# Altium schematic sheet 原理图.schdoc
size 430 x 307 mm
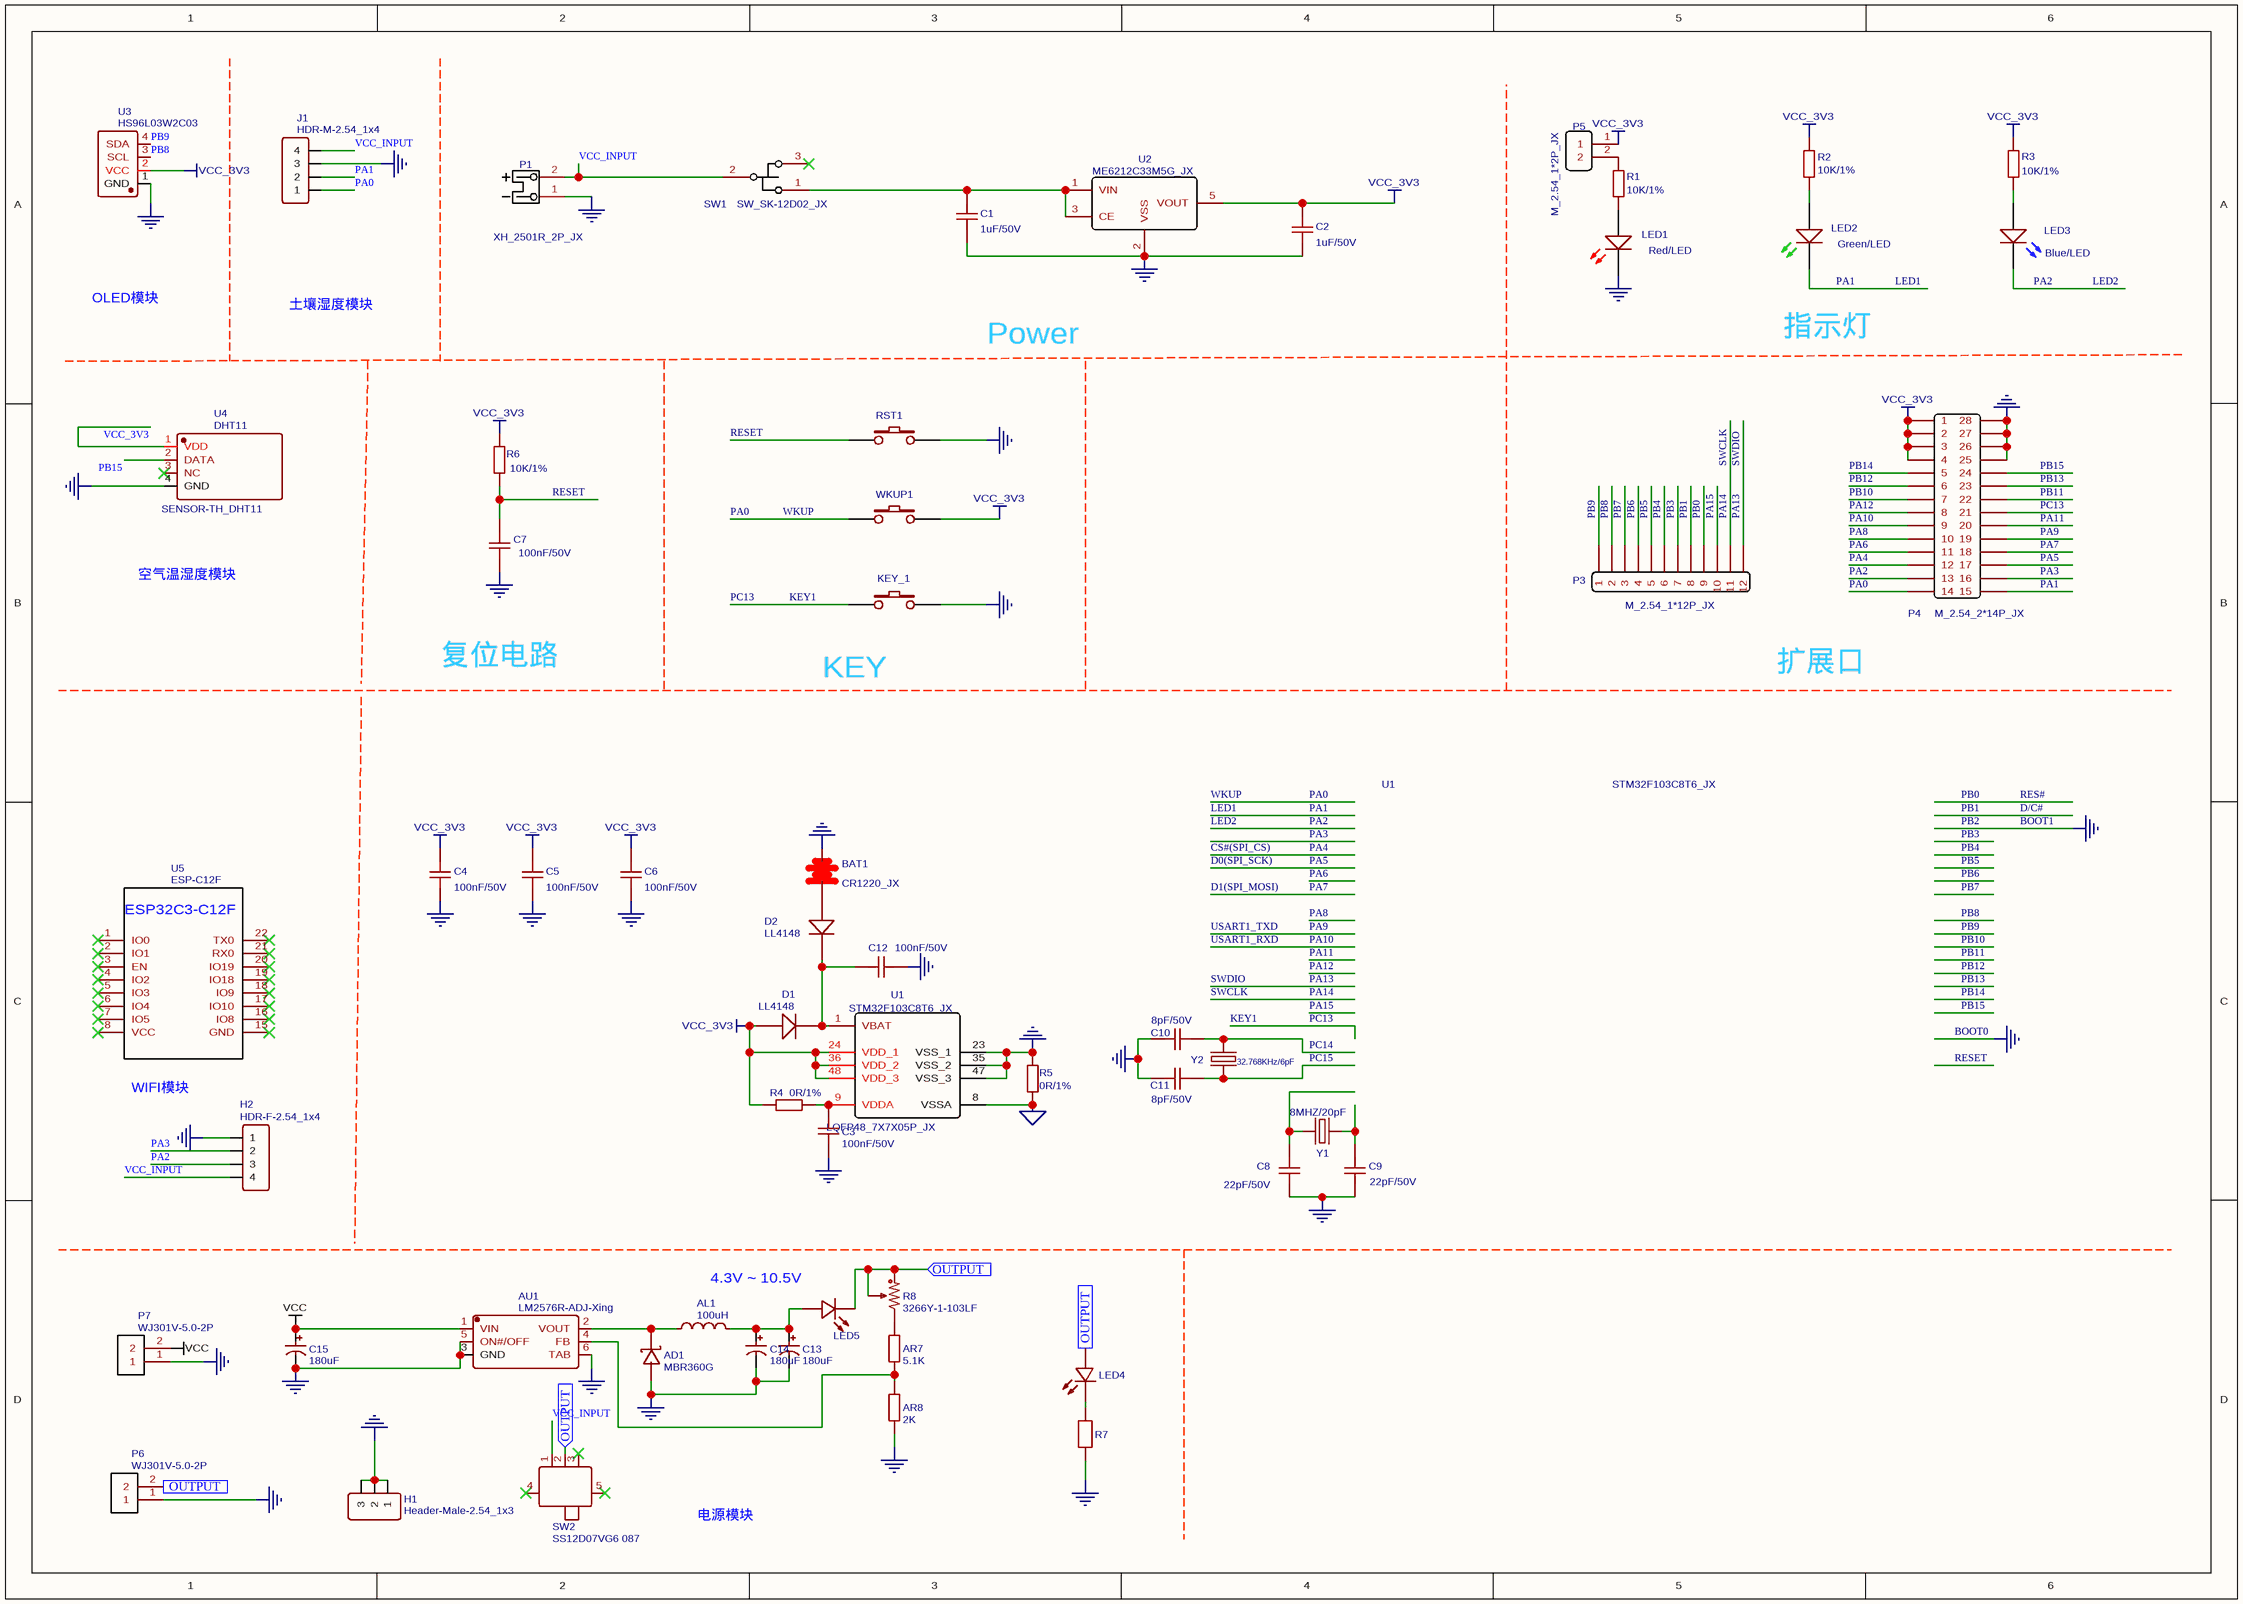
[diagram p0: 原理图.schdoc]

## Parts
(Parts that share a designator on the sheet are numbered #1, #2 ... from top to bottom, then left to right.)
AD1  MBR360G  [DO-201AD_BD5.3-L8.4-P12.50-D1.4-RD]
AL1  100uH  [IND-SMD_L5.0-W5.0]
AR7  5.1K  [R0805]
AR8  2K  [R0805]
AU1  LM2576R-ADJ-Xing  [TO-263-5_L10.6-W9.6-P1.70-LS15.9-TL]
BAT1  CR1220_JX  [CR1220_JX]
C1  1uF/50V  [0603_C_JX]
C2  1uF/50V  [0603_C_JX]
C3  100nF/50V  [0603_C_JX]
C4  100nF/50V  [0603_C_JX]
C5  100nF/50V  [0603_C_JX]
C6  100nF/50V  [0603_C_JX]
C7  100nF/50V  [0603_C_JX]
C8  22pF/50V  [0603_C_JX]
C9  22pF/50V  [0603_C_JX]
C10  8pF/50V  [0603_C_JX]
C11  8pF/50V  [0603_C_JX]
C12  100nF/50V  [0603_C_JX]
C13  180uF  [CAP-TH_BD8.0-P3.50-D0.6-FD]
C14  180uF  [CAP-TH_BD8.0-P3.50-D0.6-FD]
C15  180uF  [CAP-TH_BD8.0-P3.50-D0.6-FD]
D1  LL4148  [LL-34_JX]
D2  LL4148  [LL-34_JX]
H1  Header-Male-2.54_1x3  [HDR-TH_3P-P2.54-V]
H2  HDR-F-2.54_1x4  [HDR-F-2.54_1X4]
J1  HDR-M-2.54_1x4  [HDR-M-2.54_1X4]
KEY_1  K2-1101UT-B4SW-01_JX  [SW_PUSH_2P_6MM_H5MM_JX]  (value not drawn)
LED1  Red/LED  [0603_D_JX]
LED2  Green/LED  [0603_D_JX]
LED3  Blue/LED  [0603_D_JX]
LED4  17-215/S2C-BJ1K2AX/3T  [LED0805-R-RD]  (value not drawn)
LED5  17-215/S2C-BJ1K2AX/3T  [LED0805-R-RD]  (value not drawn)
P1  XH_2501R_2P_JX  [XH_2501R_2P_JX]
P3  M_2.54_1*12P_JX  [M_2.54_1*12P_JX]
P4  M_2.54_2*14P_JX  [M_2.54_2*14P_JX]
P5  M_2.54_1*2P_JX  [M_2.54_1*2P_JX]
P6  WJ301V-5.0-2P  [CONN-TH_2P-P5.00_WJ301V-5.00-2P]
P7  WJ301V-5.0-2P  [CONN-TH_2P-P5.00_WJ301V-5.00-2P]
R1  10K/1%  [0603_R_JX]
R2  10K/1%  [0603_R_JX]
R3  10K/1%  [0603_R_JX]
R4  0R/1%  [0603_R_JX]
R5  0R/1%  [0603_R_JX]
R6  10K/1%  [0603_R_JX]
R7  1M  [R0805]  (value not drawn)
R8  3266Y-1-103LF  [RES-ADJ-TH_3266Y]
RST1  K2-1101UT-B4SW-01_JX  [SW_PUSH_2P_6MM_H5MM_JX]  (value not drawn)
SW1  SW_SK-12D02_JX  [SW_SK-12D02_JX]
SW2  SS12D07VG6 087  [SW-TH_SS12D07VG4]
U1#1  STM32F103C8T6_JX  [LQFP48_7X7X05P_JX]
U1#2  STM32F103C8T6_JX  [LQFP48_7X7X05P_JX]
U2  ME6212C33M5G_JX  [SOT23-5_JX]
U3  HS96L03W2C03  [OLED-TH_L27.8-W27.2-P2.54_C9900033791]
U4  DHT11  [SENSOR-TH_DHT11]
U5  ESP-C12F  [ESP12F]
WKUP1  K2-1101UT-B4SW-01_JX  [SW_PUSH_2P_6MM_H5MM_JX]  (value not drawn)
Y1  8MHZ/20pF  [HC-49SMD_JX]
Y2  32.768KHz/6pF  [SMD_3215_2P_JX]

## Ports
OUTPUT (in)

## Nets
AGND: R5.1 U1#2.8(VSSA)
BOOT0: AD1.2(A) AR8.1 AU1.3(GND) AU1.5(ON#/OFF) AU1.6(TAB) BAT1.2 C1.1 C2.1 C3.2 C4.1 C5.1 C6.1 C7.1 C8.2 C9.2 C10.2 C11.1 C12.2 C13.2 C14.2 C15.2 H1.1 H1.2 H1.3 H2.1 J1.3 KEY_1.2 LED1.2(C) P1.1 P4.25 P4.26 P4.27 P4.28 P6.1 P7.1 R5.2 R7.2 RST1.2 U1#2.23(VSS_1) U1#2.35(VSS_2) U1#2.47(VSS_3) U2.2(VSS) U3.1(GND) U4.4(GND)  [also labelled BOOT1, GND, PB2]
VCC: AU1.1(VIN) C15.1 P7.2
VCC_3V3: C2.2 C4.2 C5.2 C6.2 D1.1(A) P4.1 P4.2 P4.3 P4.4 P5.1 R2.2 R3.2 R4.1 R6.1 U1#2.24(VDD_1) U1#2.36(VDD_2) U1#2.48(VDD_3) U2.5(VOUT) U3.2(VCC) U4.1(VDD) WKUP1.2
CS#(SPI_CS): P4.12  [also labelled PA4]
D0(SPI_SCK): P4.17  [also labelled PA5]
D1(SPI_MOSI): P4.18  [also labelled PA7]
D/C#: P3.8  [also labelled PB1]
KEY1: KEY_1.1 P4.21  [also labelled PC13]
LED1: J1.2 LED2.2(C) P4.15  [also labelled PA1]
LED2: H2.3 LED3.2(C) P4.13  [also labelled PA2]
OUTPUT: LED4.1(+) LED5.2(-) P6.2 R8.1 R8.2 SW2.2 ; port OUTPUT
PA0: J1.1 P4.14 WKUP1.1  [also labelled WKUP]
PA3: H2.2 P4.16
PA6: P4.11
PA8: P4.10
PA9: P4.19  [also labelled USART1_TXD]
PA10: P4.9  [also labelled USART1_RXD]
PA11: P4.20
PA12: P4.8
PA13: P3.12  [also labelled SWDIO]
PA14: P3.11  [also labelled SWCLK]
PA15: P3.10
PB0: P3.9  [also labelled RES#]
PB3: P3.7
PB4: P3.6
PB5: P3.5
PB6: P3.4
PB7: P3.3
PB8: P3.2 U3.3(SCL)
PB9: P3.1 U3.4(SDA)
PB10: P4.7
PB11: P4.22
PB12: P4.6
PB13: P4.23
PB14: P4.5
PB15: P4.24 U4.2(DATA)
PC14: C10.1 Y2.2
PC15: C11.2 Y2.1
RESET: C7.2 R6.2 RST1.1
VCC_INPUT: H2.4 J1.4 P1.2 SW1.2 SW2.1
NetAD1_1: AD1.1(C) AL1.1 AU1.2(VOUT)
NetAL1_2: AL1.2 C13.1 C14.1 LED5.1(+)
NetAR7_1: AR7.1 AR8.2 AU1.4(FB)
NetAR7_2: AR7.2 R8.3
NetBAT1_1: BAT1.1 D2.1(A)
NetC1_2: C1.2 SW1.1 U2.1(VIN) U2.3(CE)
NetC3_1: C3.1 R4.2 U1#2.9(VDDA)
NetC8_1: C8.1 Y1.1
NetC9_1: C9.1 Y1.2
NetC12_1: C12.1 D1.2(K) D2.2(K) U1#2.1(VBAT)
NetLED1_1: LED1.1(A) R1.1
NetLED2_1: LED2.1(A) R2.1
NetLED3_1: LED3.1(A) R3.1
NetLED4_2: LED4.2(-) R7.1
NetP5_2: P5.2 R1.2

Not connected (* = marked no-connect by the designer): SW1 3*; SW2 3* 4* 5*; U4 3(NC)*; U5 1(IO0)* 2(IO1)* 3(EN)* 4(IO2)* 5(IO3)* 6(IO4)* 7(IO5)* 8(VCC)* 15(GND)* 16(IO8)* 17(IO10)* 18(IO9)* 19(IO18)* 20(IO19)* 21(RX0)* 22(TX0)*

## Notes on the sheet
- OLED模块
- 土壤湿度模块
- Power
- 指示灯
- 空气温湿度模块
- 复位电路
- (near KEY_1) KEY
- 扩展口
- (near U5) WIFI模块
- 4.3V ~ 10.5V
- 电源模块
- (in symbol DHT11) SENSOR-TH_DHT11
- (in symbol ESP-C12F) ESP32C3-C12F
- (in symbol STM32F103C8T6_JX) LQFP48_7X7X05P_JX

## Library data of the parts
AD1 = MBR360G: Manufacturer: ON Semicon; Contributor: LCSC; Supplier: LCSC; Supplier Part: C150251; Manufacturer Part: MBR360G; spicePre: D; spiceSymbolName: MBR360G
AL1 = 100uH: Manufacturer: Sunlord; Manufacturer Part: SWPA5040S101MT; nameAlias: Inductance; Supplier: LCSC; Supplier Part: C88132; spicePre: L; spiceSymbolName: SWPA5040S101MT
AR7 = 5.1K: Manufacturer: Tyohm; Manufacturer Part: RMC08055.1K5%N; nameAlias: Resistance (Ohms); Contributor: LCSC; Supplier: LCSC; Supplier Part: C269736; JLCPCB Part Class: Extended Part; spicePre: R; spiceSymbolName: RMC08055.1K5%N
AR8 = 2K: Manufacturer: Tyohm; Manufacturer Part: RMC08052K5%N; nameAlias: Resistance (Ohms); Contributor: LCSC; Supplier: LCSC; Supplier Part: C269731; JLCPCB Part Class: Extended Part; spicePre: R; spiceSymbolName: RMC08052K5%N
AU1 = LM2576R-ADJ-Xing: Manufacturer: HTC; SMT Type: Extend; Contributor: laoyaodao; Supplier: LCSC; Manufacturer Part: LM2576R-ADJ; Supplier Part: C91092; LCSC Assembly: Yes; spicePre: U; spiceSymbolName: LM2576R-ADJ-Xing
C1 C2 = 1uF/50V: nameAlias: Value(F); spicePre: C; spiceSymbolName: Capacitor; Supplier: LCSC
C3-C7 C12 = 100nF/50V: nameAlias: Value(F); spicePre: C; spiceSymbolName: Capacitor; Supplier: LCSC
C8 C9 = 22pF/50V: nameAlias: Value(F); spicePre: C; spiceSymbolName: Capacitor; Supplier: LCSC
C10 C11 = 8pF/50V: nameAlias: Value(F); spicePre: C; spiceSymbolName: Capacitor; Supplier: LCSC
C13-C15 = 180uF: Manufacturer: AISHI; Manufacturer Part: ERZ1HM181F16OT; nameAlias: Capacitance; Supplier: LCSC; Supplier Part: C106716; JLCPCB Part Class: Extended Part; spicePre: C; spiceSymbolName: ERZ1HM181F16OT
H1 = Header-Male-2.54_1x3: Manufacturer: BOOMELE; Manufacturer Part: Header2.54mm 1*3P; Supplier: LCSC; Supplier Part: C49257; JLCPCB Part Class: Extended Part; spicePre: H; spiceSymbolName: Header-Male-2.54_1x3
H2 = HDR-F-2.54_1x4: Contributor: LCEDA_Lib; Supplier Part: C225501; Supplier: LCSC; spicePre: H; spiceSymbolName: HDR-F-2.54_1x4
J1 = HDR-M-2.54_1x4: Contributor: LCEDA_Lib; Supplier Part: C124378; Supplier: LCSC; spicePre: J; spiceSymbolName: HDR-M-2.54_1x4
LED4 LED5 = 17-215/S2C-BJ1K2AX/3T: Manufacturer: EVERLIGHT; Supplier: LCSC; Manufacturer Part: 17-215/S2C-BJ1K2AX/3T; Supplier Part: C95814; spicePre: L; spiceSymbolName: 17-215/S2C-BJ1K2AX/3T
P1 = XH_2501R_2P_JX: catid: 20; Supplier: LCSC; spicePre: P
P6 P7 = WJ301V-5.0-2P: Manufacturer: ReliaPro; Supplier: LCSC; Manufacturer Part: WJ301V-5.0-2P; Supplier Part: C8475; JLCPCB Part Class: Extended Part; spicePre: P; spiceSymbolName: WJ301V-5.0-2P
R1-R3 R6 = 10K/1%: nameAlias: Value(Ω); spicePre: R; spiceSymbolName: Resistor; Supplier: LCSC
R4 R5 = 0R/1%: nameAlias: Value(Ω); spicePre: R; spiceSymbolName: Resistor; Supplier: LCSC
R7 = 1M: Manufacturer: Uniroyal Elec; Manufacturer Part: 0805W8F1002T5E; nameAlias: Resistance (Ohms); Contributor: LCSC; SMT Type: Extend; Supplier: LCSC; Supplier Part: C38522; LCSC Assembly: Yes; spicePre: R; spiceSymbolName: 0805W8F1002T5E_C38522
R8 = 3266Y-1-103LF: Manufacturer: BOURNS; Contributor: LCSC; Supplier: LCSC; Supplier Part: C719182; Manufacturer Part: 3266Y-1-103LF; JLCPCB Part Class: Extended Part; spicePre: R; spiceSymbolName: 3266Y-1-103LF
SW2 = SS12D07VG6 087: Manufacturer: SHOU HAN(首韩); Contributor: LCSC; Supplier: LCSC; Supplier Part: C2939728; Manufacturer Part: SS12D07VG6 087; JLCPCB Part Class: Extended Part; spicePre: S; spiceSymbolName: SS12D07VG6 087
U1#1 U1#2 = STM32F103C8T6_JX: catid: 20; Package Display: Yes; timeStamp: 1455028086; Supplier: LCSC; spicePre: U
U3 = HS96L03W2C03: Manufacturer: HS(汉昇); Contributor: lcsc; Supplier: LCSC; Supplier Part: C5248080; Manufacturer Part: HS96L03W2C03; JLCPCB Part Class: Extended Part; spicePre: U; spiceSymbolName: HS96L03W2C03
U4 = DHT11: Manufacturer: 广州奥松; Contributor: LCSC; Package Display: Yes; Supplier: LCSC; Supplier Part: C117051; Manufacturer Part: DHT11; JLCPCB Part Class: Extended Part; spicePre: U; spiceSymbolName: DHT11
U5 = ESP-C12F: subpart_no: 1; Contributor: liaozhihong; spicePre: U; spiceSymbolName: ESP-C12F
Y1 = 8MHZ/20pF: catid: 20; spicePre: Y; Supplier: LCSC
BAT1 = CR1220_JX: Supplier: LCSC; spicePre: B
D1 D2 = LL4148: Supplier: LCSC; spicePre: D
KEY_1 RST1 WKUP1 = K2-1101UT-B4SW-01_JX: Supplier: LCSC; spicePre: S
LED1 = Red/LED: Supplier: LCSC; spicePre: L
LED2 = Green/LED: Supplier: LCSC; spicePre: L
LED3 = Blue/LED: Supplier: LCSC; spicePre: L
P3 = M_2.54_1*12P_JX: Supplier: LCSC; spicePre: P
P4 = M_2.54_2*14P_JX: Supplier: LCSC; spicePre: P
P5 = M_2.54_1*2P_JX: Supplier: LCSC; spicePre: P
SW1 = SW_SK-12D02_JX: Supplier: LCSC; spicePre: S
U2 = ME6212C33M5G_JX: Supplier: LCSC; spicePre: U
Y2 = 32.768KHz/6pF: Supplier: LCSC; spicePre: Y